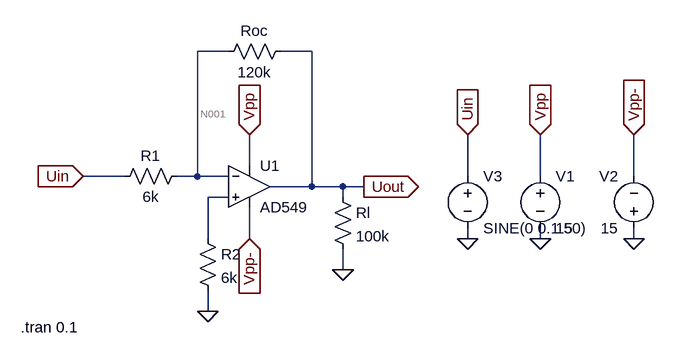
[diagram p0: schematic Task2.asc]
Task2.asc, the LTspice schematic file:
Version 4
SHEET 1 1160 680
WIRE 128 -16 80 -16
WIRE 256 -16 208 -16
WIRE 160 160 160 112
WIRE -32 176 -96 176
WIRE 80 176 80 -16
WIRE 80 176 48 176
WIRE 128 176 80 176
WIRE 496 176 496 112
WIRE 608 176 608 112
WIRE 752 176 752 112
WIRE 256 192 256 -16
WIRE 256 192 192 192
WIRE 304 192 256 192
WIRE 336 192 304 192
WIRE 128 208 96 208
WIRE 304 208 304 192
WIRE 96 272 96 208
WIRE 160 272 160 224
WIRE 496 272 496 256
WIRE 608 272 608 256
WIRE 752 272 752 256
WIRE 304 320 304 288
WIRE 96 384 96 352
FLAG 496 112 Uin
IOPIN 496 112 In
FLAG -96 176 Uin
IOPIN -96 176 In
FLAG 336 192 Uout
IOPIN 336 192 Out
FLAG 160 112 Vpp
IOPIN 160 112 In
FLAG 160 272 Vpp-
IOPIN 160 272 In
FLAG 96 384 0
FLAG 304 320 0
FLAG 608 112 Vpp
IOPIN 608 112 In
FLAG 752 112 Vpp-
IOPIN 752 112 In
FLAG 496 272 0
FLAG 608 272 0
FLAG 752 272 0
SYMBOL OpAmps\\AD549 160 128 R0
SYMATTR InstName U1
SYMBOL res 80 256 R0
SYMATTR InstName R2
SYMATTR Value 6k
SYMBOL res 64 160 R90
WINDOW 0 0 56 VBottom 2
WINDOW 3 32 56 VTop 2
SYMATTR InstName R1
SYMATTR Value 6k
SYMBOL res 288 192 R0
SYMATTR InstName Rl
SYMATTR Value 100k
SYMBOL res 224 -32 R90
WINDOW 0 0 56 VBottom 2
WINDOW 3 32 56 VTop 2
SYMATTR InstName Roc
SYMATTR Value 120k
SYMBOL voltage 496 160 R0
WINDOW 123 0 0 Left 0
WINDOW 39 0 0 Left 0
SYMATTR InstName V3
SYMATTR Value SINE(0 0.1 50)
SYMBOL voltage 608 160 R0
SYMATTR InstName V1
SYMATTR Value 15
SYMBOL voltage 752 272 R180
WINDOW 0 24 96 Left 2
WINDOW 3 24 16 Left 2
SYMATTR InstName V2
SYMATTR Value 15
TEXT -192 408 Left 2 !.tran 0.1

The netlist it stands for:
* Task2.asc
XU1 N002 N001 Vpp Vpp- Uout AD549  ; pins In+ In- V+ V- OUT
R2 N002 0 6k
R1 N001 Uin 6k
Rl Uout 0 100k
Roc Uout N001 120k
V3 Uin 0 SINE(0 0.1 50)
V1 Vpp 0 15
V2 0 Vpp- 15
.tran 0.1
.backanno
.end

* Results of the author's LTspice run, read from the files saved beside the schematic
* Operating Point, zero values left out:
*   V(n001) = -359 nV
*   V(vpp) = 15 V
*   V(uout) = -7.538 µV
*   V(vpp-) = -15 V
*   I(Roc) = -59.83 pA
*   I(Rl) = -75.38 pA
*   I(R1) = -59.83 pA
*   I(V2) = -794.4 µA
*   I(V1) = -794.4 µA
*   I(V3) = -59.83 pA
*   Ix(u1:3) = 794.4 µA
*   Ix(u1:4) = -794.4 µA
*   Ix(u1:5) = 135.2 pA
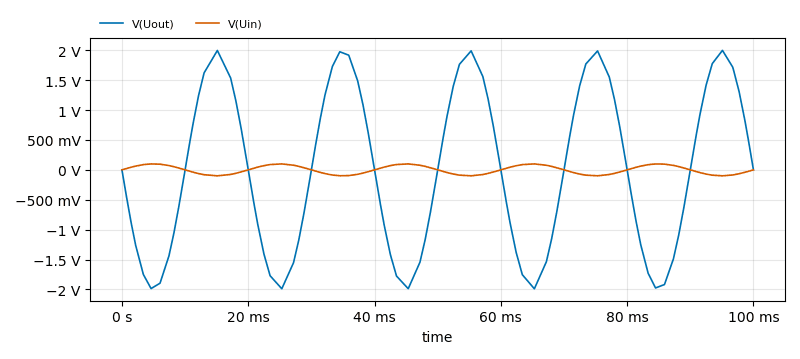
[diagram p1: Transient Analysis of Task2.asc, plotted from the saved traces]
* Transient Analysis, 1 run:
*   V(Uout): min -1.989 V, max 1.998 V, average -882.2 µV, rms 1.395 V, last 2.018 mV
*   V(Uin): min -99.92 mV, max 99.45 mV, average 43.74 µV, rms 69.77 mV, last 0 V